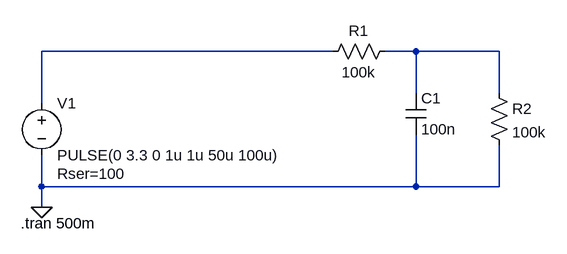
[diagram p0: schematic PWM_filter.asc]
PWM_filter.asc, the LTspice schematic file:
Version 4
SHEET 1 880 680
WIRE 416 64 -32 64
WIRE 544 64 496 64
WIRE 672 64 544 64
WIRE 544 128 544 64
WIRE 672 128 672 64
WIRE -32 144 -32 64
WIRE -32 272 -32 224
WIRE 544 272 544 192
WIRE 544 272 -32 272
WIRE 672 272 672 208
WIRE 672 272 544 272
WIRE -32 304 -32 272
FLAG -32 304 0
SYMBOL voltage -32 128 R0
WINDOW 123 0 0 Left 0
WINDOW 39 24 124 Left 2
SYMATTR SpiceLine Rser=100
SYMATTR InstName V1
SYMATTR Value PULSE(0 3.3 0 1u 1u 50u 100u)
SYMBOL res 512 48 R90
WINDOW 0 0 56 VBottom 2
WINDOW 3 32 56 VTop 2
SYMATTR InstName R1
SYMATTR Value 100k
SYMBOL cap 528 128 R0
SYMATTR InstName C1
SYMATTR Value 100n
SYMBOL res 656 112 R0
SYMATTR InstName R2
SYMATTR Value 100k
TEXT -64 328 Left 2 !.tran 500m

The netlist it stands for:
* PWM_filter.asc
V1 N001 0 PULSE(0 3.3 0 1u 1u 50u 100u) Rser=100
R1 N002 N001 100k
C1 N002 0 100n
R2 N002 0 100k
.tran 500m
.backanno
.end